# Altium schematic sheet LV Power Supply.SchDoc
size OrCAD A
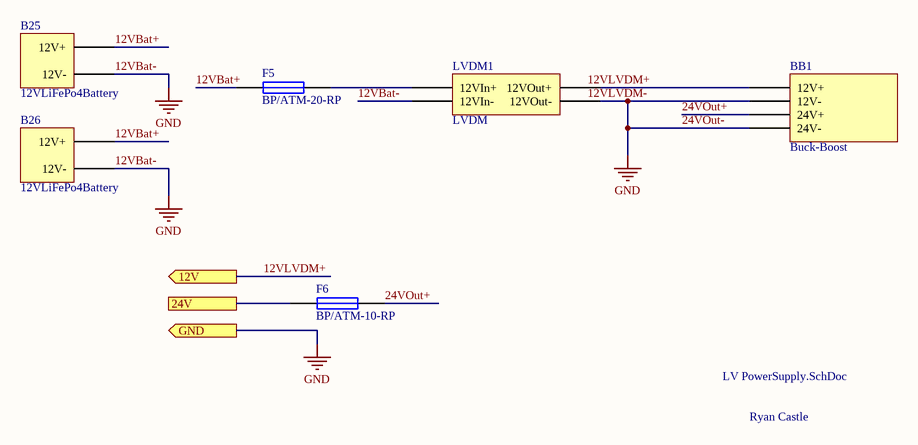
[diagram p0: LV Power Supply.SchDoc]

## Parts
B25  12VLiFePo4Battery
B26  12VLiFePo4Battery
BB1  Buck-Boost
F5  BP/ATM-20-RP  [PIN-W2/E2.8]
F6  BP/ATM-10-RP  [PIN-W2/E2.8]
LVDM1  LVDM

## Ports
12V (out), 24V, GND (out)

## Nets
12VBat-: B25.2(12V-) B26.2(12V-) BB1.13(24V-) BB1.15(12V-) LVDM1.10(12VIn-) LVDM1.12(12VOut-) ; port GND  [also labelled 24VOut-, GND]
12VBat+: B25.1(12V+) B26.1(12V+) F5.1
12VLVDM+: port 12V
24V: F6.1 ; port 24V
24VOut+: BB1.14(24V+) F6.2
NetBB1_16: BB1.16(12V+) LVDM1.11(12VOut+)
NetF5_2: F5.2 LVDM1.9(12VIn+)

## Notes on the sheet
- LV PowerSupply.SchDoc
- Ryan Castle
- Labels drawn without touching a wire or pin: 12VLVDM+, 12VLVDM-

## Library data of the parts
BB1 = 12-24 BuckBoost
F5 F6 = Fuse 1: Fuse; Published: 8-Jun-2000; LatestRevisionDate: 17-Jul-2002; LatestRevisionNote: Re-released for DXP Platform.; PackageReference: PIN-W2/E2.8; Publisher: Altium Limited; PackageDescription: Thru-Hole; 2 Leads